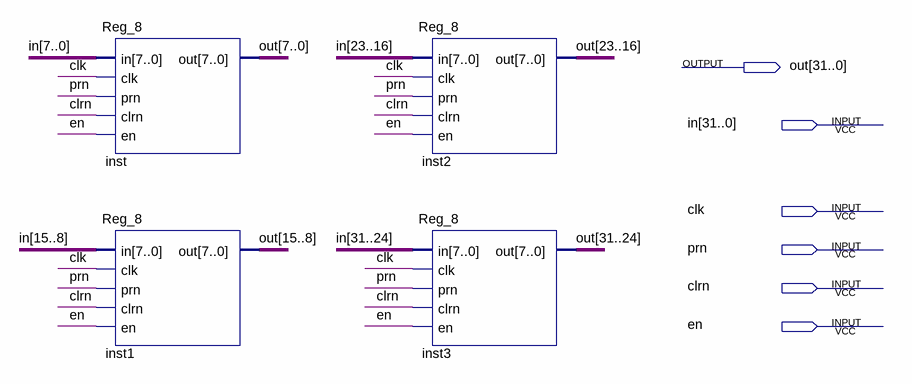
[diagram p0: schematic sheet]
// Quartus schematic Reg_32.bdf as structural Verilog: 4 symbols, 6 pins
module Reg_32 (
  input  [31:0] in,
  input  clk,
  input  prn,
  input  clrn,
  input  en,
  output [31:0] out
);

  Reg_8 inst (.in(in[7:0]), .clk(clk), .prn(prn), .clrn(clrn), .en(en), .out(out[7:0]));
  Reg_8 inst1 (.in(in[15:8]), .clk(clk), .prn(prn), .clrn(clrn), .en(en), .out(out[15:8]));
  Reg_8 inst2 (.in(in[23:16]), .clk(clk), .prn(prn), .clrn(clrn), .en(en), .out(out[23:16]));
  Reg_8 inst3 (.in(in[31:24]), .clk(clk), .prn(prn), .clrn(clrn), .en(en), .out(out[31:24]));
endmodule
